# EAGLE schematic LSM9DS1 (EAGLE 7.6.0)
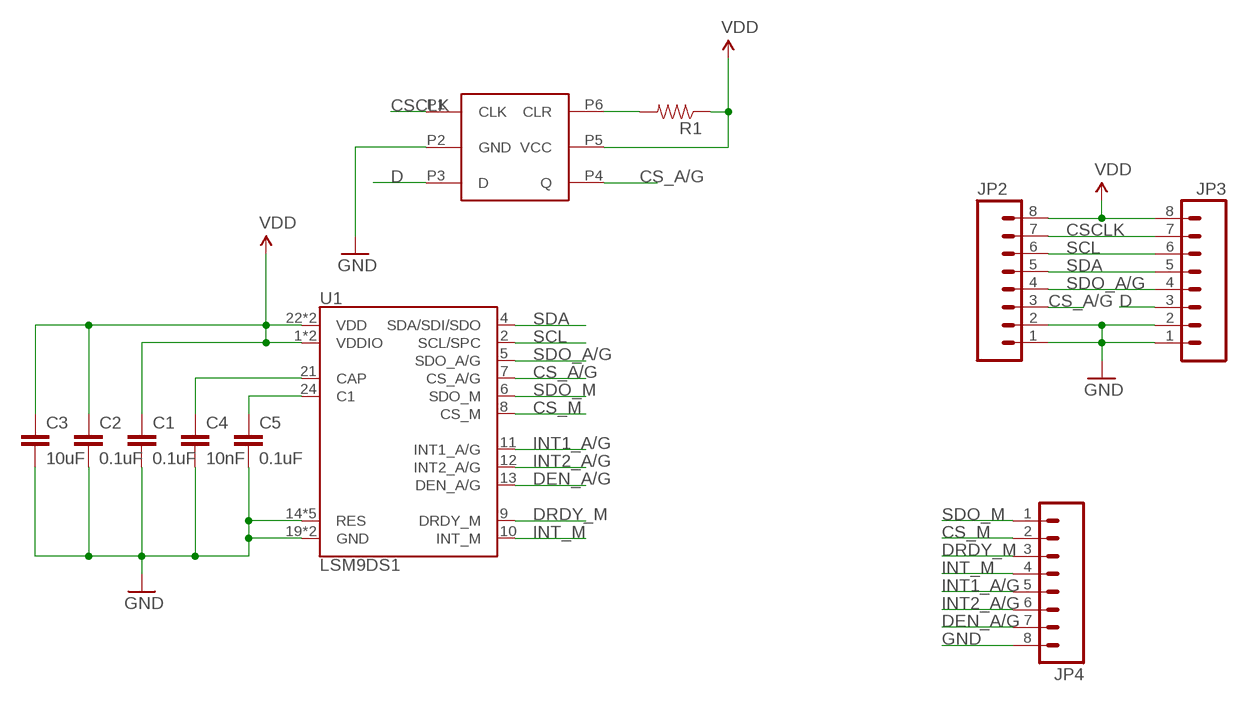
[diagram p0: schematic, sheet 1]

## Parts
C1  0.1uF  CAP0603-CAP  [0603-CAP]
C2  0.1uF  CAP0603-CAP  [0603-CAP]
C3  10uF  CAP0603-CAP  [0603-CAP]
C4  10nF  CAP0603-CAP  [0603-CAP]
C5  0.1uF  CAP0603-CAP  [0603-CAP]
JP2  M08BM08B-SRSS-TB  [BM08B-SRSS-TB]
JP3  M08BM08B-SRSS-TB  [BM08B-SRSS-TB]
JP4  M08BM08B-SRSS-TB  [BM08B-SRSS-TB]
R1  RESISTOR0603-RES  [0603-RES]
U1  LSM9DS1  [LGA24-8X4]
U$1  SN74LVC1G175  [SN74LVC1G175]

## Nets
CS_A/G: JP2.3 U1.7(CS_A/G) U$1.P4(Q)
CS_M: JP4.2 U1.8(CS_M)
CSCLK: JP2.7 JP3.7 U$1.P1(CLK)
D: JP3.3 U$1.P3(D)
DEN_A/G: JP4.7 U1.13(DEN_A/G)
DRDY_M: JP4.3 U1.9(DRDY_M)
GND: C1.2 C2.2 C3.2 C4.2 C5.2 JP2.1 JP2.2 JP3.1 JP3.2 JP4.8 U1.14(RES) U1.15(RES) U1.16(RES) U1.17(RES) U1.18(RES) U1.19(GND) U1.20(GND) U$1.P2(GND)
INT1_A/G: JP4.5 U1.11(INT1_A/G)
INT2_A/G: JP4.6 U1.12(INT2_A/G)
INT_M: JP4.4 U1.10(INT_M)
N$1: R1.2 U$1.P6(CLR)
N$2: C4.1 U1.21(CAP)
N$3: C5.1 U1.24(C1)
SCL: JP2.6 JP3.6 U1.2(SCL/SPC)
SDA: JP2.5 JP3.5 U1.4(SDA/SDI/SDO)
SDO_A/G: JP2.4 JP3.4 U1.5(SDO_A/G)
SDO_M: JP4.1 U1.6(SDO_M)
VDD: C1.1 C2.1 C3.1 JP2.8 JP3.8 R1.1 U1.1(VDDIO) U1.3(VDDIO) U1.22(VDD) U1.23(VDD) U$1.P5(VCC)

## Library data of the parts
C1-C5 = SparkFun-Passives:CAP: Capacitor Standard 0603 ceramic capacitor, and 0.1" leaded capacitor.
JP2-JP4 = SparkFun-Connectors:M08: Header 8 Standard 8-pin 0.1" header. Use with straight break away headers (SKU : PRT-00116), right angle break away headers (PRT-00553), swiss pins (PRT-00743), machine pins (PRT-00117), and female headers (PRT-00115).
R1 = SparkFun-Passives:RESISTOR: Resistor Basic schematic elements and footprints for 0603, 1206, and PTH resistors.
U1 = SparkFun-Sensors:LSM9DS1: LSM9DS1 3D accelerometer, gyroscope & magnetometer The LSM9DS1 is a system-in-package featuring a 3D digital linear acceleration sensor, a 3D digital angular rate sensor, and a 3D digital magnetic sensor. The LSM9DS1 has a linear acceleration full scale of ±2g/±4g/±8/±16 g, a magnetic field full scale of ±4/±8/±12/±16 gauss and an angular rate of ±245/±500/±2000 dps. The LSM9DS1 includes an I2 C serial bus interface supporting standard and fast mode (100 kHz and 400 kHz) and an SPI serial standard interface. Magnetic, accelerometer and gyroscope sensing can be enabled or set in power-down mode separately for smart power management. The LSM9DS1 is available in a plastic land grid array package (LGA) and it is guaranteed to operate over an extended temperature range from -40 °C to +85 °C.; PROD_ID: IC-12536
U$1 = CSL_Components:SN74LVC1G175